# Altium schematic sheet F28335_V1.1.SchDoc
size C
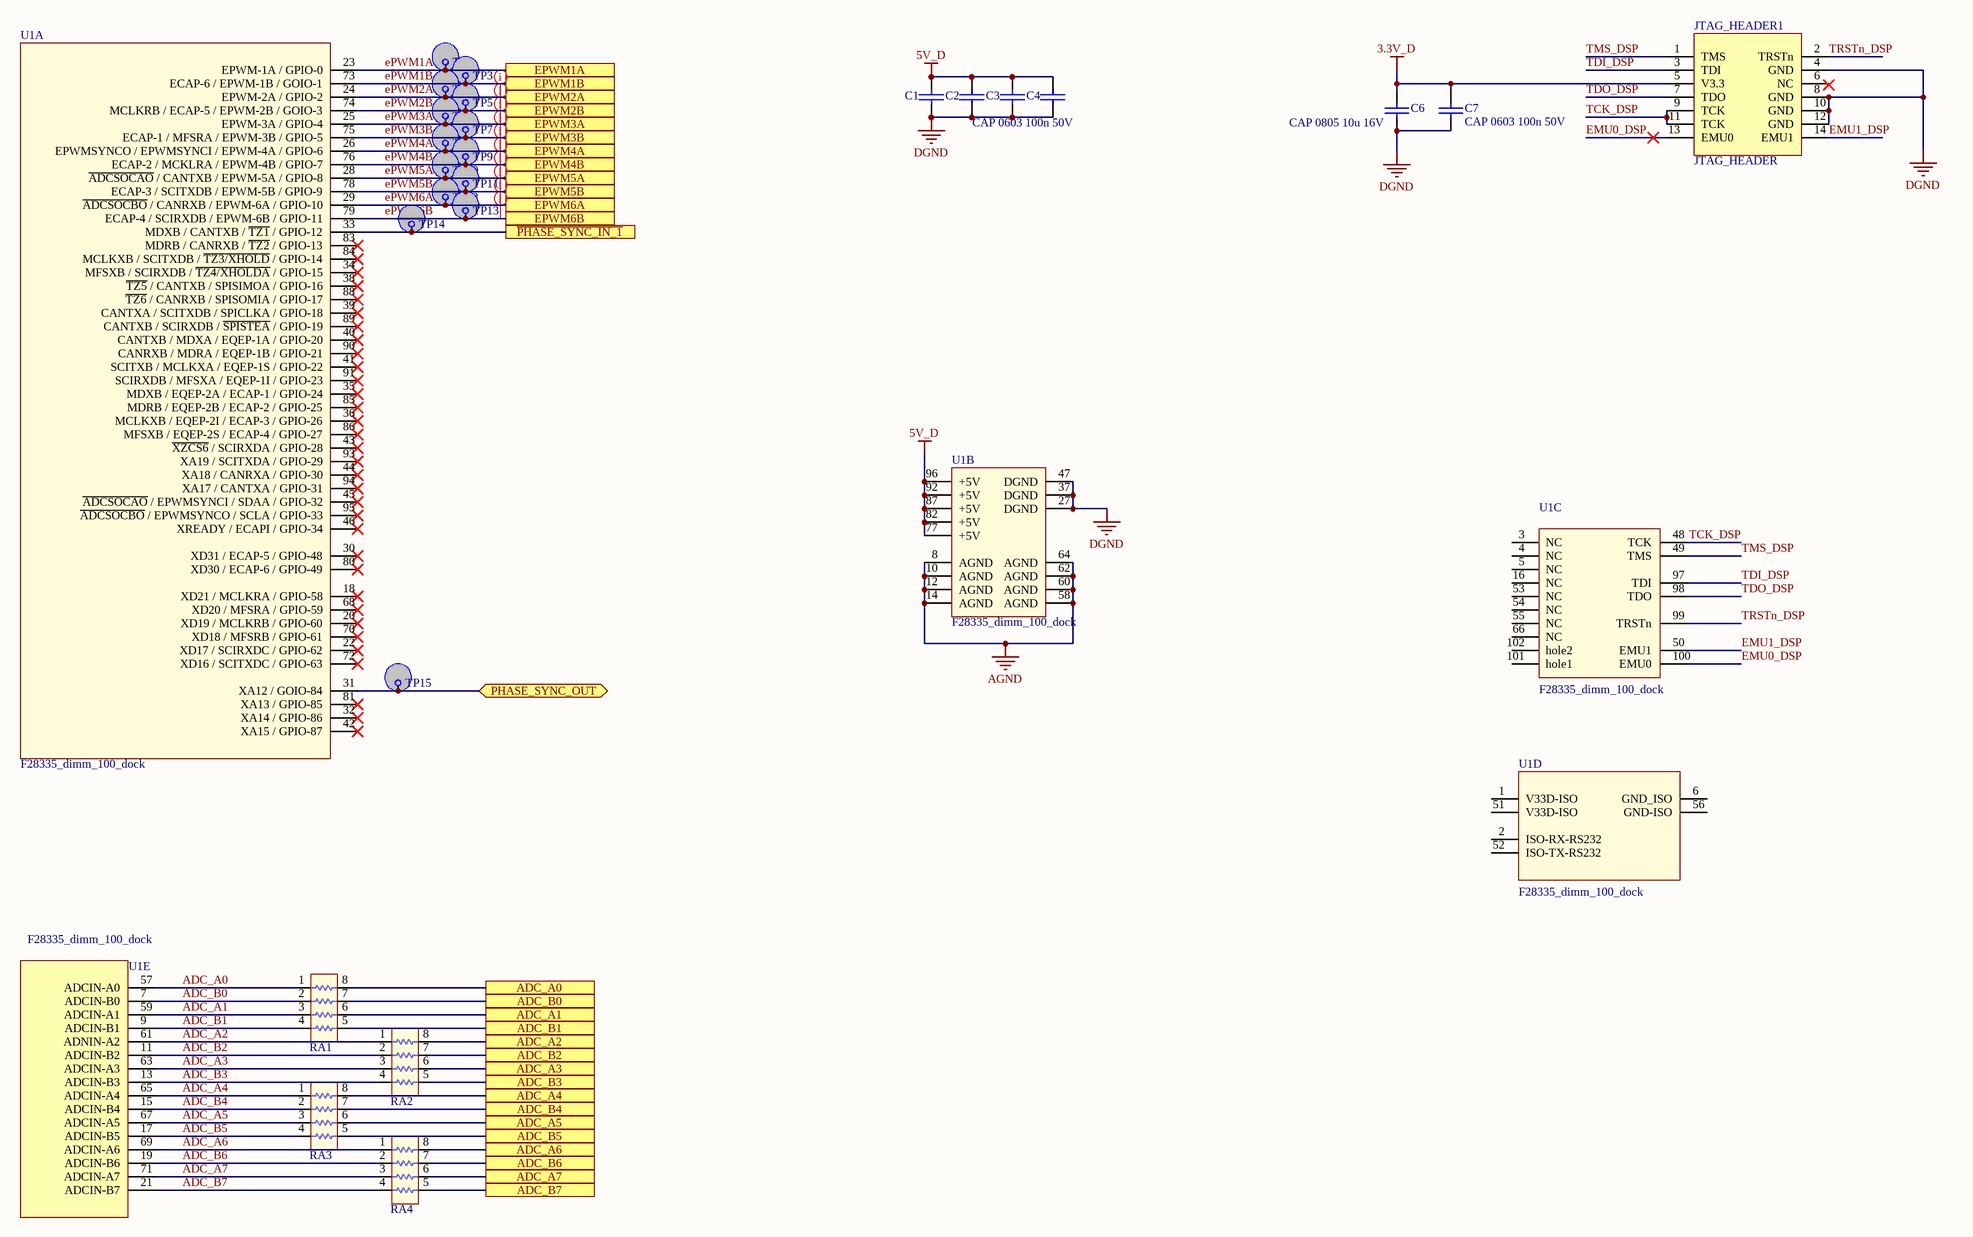
[diagram p0: F28335_V1.1.SchDoc]

## Parts
C1  CAP 0603 100n 50V  [CAPC1608N]
C2  CAP 0603 100n 50V  [CAPC1608N]  (value not drawn)
C3  CAP 0603 100n 50V  [CAPC1608N]  (value not drawn)
C4  CAP 0603 100n 50V  [CAPC1608N]  (value not drawn)
C6  CAP 0805 10u 16V  [CAPC2012N]
C7  CAP 0603 100n 50V  [CAPC1608N]
JTAG_HEADER1  JTAG_HEADER  [JTag_Header]
RA1  EXB38V 0 OHM  [EXB38V]  (value not drawn)
RA2  EXB38V 0 OHM  [EXB38V]  (value not drawn)
RA3  EXB38V 0 OHM  [EXB38V]  (value not drawn)
RA4  EXB38V 0 OHM  [EXB38V]  (value not drawn)
TP2  TEST_POINT_HOOK  [Keystone 5000]  (value not drawn)
TP3  TEST_POINT_HOOK  [Keystone 5000]  (value not drawn)
TP4  TEST_POINT_HOOK  [Keystone 5000]  (value not drawn)
TP5  TEST_POINT_HOOK  [Keystone 5000]  (value not drawn)
TP6  TEST_POINT_HOOK  [Keystone 5000]  (value not drawn)
TP7  TEST_POINT_HOOK  [Keystone 5000]  (value not drawn)
TP8  TEST_POINT_HOOK  [Keystone 5000]  (value not drawn)
TP9  TEST_POINT_HOOK  [Keystone 5000]  (value not drawn)
TP10  TEST_POINT_HOOK  [Keystone 5000]  (value not drawn)
TP11  TEST_POINT_HOOK  [Keystone 5000]  (value not drawn)
TP12  TEST_POINT_HOOK  [Keystone 5000]  (value not drawn)
TP13  TEST_POINT_HOOK  [Keystone 5000]  (value not drawn)
TP14  TEST_POINT_HOOK  [Keystone 5000]  (value not drawn)
TP15  TEST_POINT_HOOK  [Keystone 5000]  (value not drawn)
U1  F28335_dimm_100_dock  [DIMM_100_100mil]  (parts A,B,C,D,E of 5)

## Ports
ADC_A0, ADC_A1, ADC_A2, ADC_A3, ADC_A4, ADC_A5, ADC_A6, ADC_A7, ADC_B0, ADC_B1, ADC_B2, ADC_B3, ADC_B4, ADC_B5, ADC_B6, ADC_B7, EPWM1A, EPWM1B, EPWM2A, EPWM2B, EPWM3A, EPWM3B, EPWM4A, EPWM4B, EPWM5A, EPWM5B, EPWM6A, EPWM6B, PHASE_SYNC_OUT, ~{PHASE_SYNC_IN_1}

## Nets
3.3V_D: C6.1 C7.1 JTAG_HEADER1.5(V3.3)
5V_D: C1.1 C2.1 C3.1 C4.1 U1.77(+5V) U1.82(+5V) U1.87(+5V) U1.92(+5V) U1.96(+5V)
AGND: U1.8(AGND) U1.10(AGND) U1.12(AGND) U1.14(AGND) U1.58(AGND) U1.60(AGND) U1.62(AGND) U1.64(AGND)
DGND: C1.2 C2.2 C3.2 C4.2 C6.2 C7.2 JTAG_HEADER1.4(GND) JTAG_HEADER1.8(GND) JTAG_HEADER1.10(GND) JTAG_HEADER1.12(GND) U1.27(DGND) U1.37(DGND) U1.47(DGND)
~{PHASE_SYNC_IN_1}: TP14.1 U1.33(MDXB_/_CANTXB_/_~{TZ1}_/_GPIO-12) ; port ~{PHASE_SYNC_IN_1}
ADC_A0: RA1.1 U1.57(ADCIN-A0)
ADC_A0: RA1.8 ; port ADC_A0  [a separate net that carries the same name]
ADC_A1: RA1.3 U1.59(ADCIN-A1)
ADC_A1: RA1.6 ; port ADC_A1  [a separate net that carries the same name]
ADC_A2: RA2.1 U1.61(ADNIN-A2)
ADC_A2: RA2.8 ; port ADC_A2  [a separate net that carries the same name]
ADC_A3: RA2.3 U1.63(ADCIN-A3)
ADC_A3: RA2.6 ; port ADC_A3  [a separate net that carries the same name]
ADC_A4: RA3.1 U1.65(ADCIN-A4)
ADC_A4: RA3.8 ; port ADC_A4  [a separate net that carries the same name]
ADC_A5: RA3.3 U1.67(ADCIN-A5)
ADC_A5: RA3.6 ; port ADC_A5  [a separate net that carries the same name]
ADC_A6: RA4.1 U1.69(ADCIN-A6)
ADC_A6: RA4.8 ; port ADC_A6  [a separate net that carries the same name]
ADC_A7: RA4.3 U1.71(ADCIN-A7)
ADC_A7: RA4.6 ; port ADC_A7  [a separate net that carries the same name]
ADC_B0: RA1.2 U1.7(ADCIN-B0)
ADC_B0: RA1.7 ; port ADC_B0  [a separate net that carries the same name]
ADC_B1: RA1.4 U1.9(ADCIN-B1)
ADC_B1: RA1.5 ; port ADC_B1  [a separate net that carries the same name]
ADC_B2: RA2.2 U1.11(ADCIN-B2)
ADC_B2: RA2.7 ; port ADC_B2  [a separate net that carries the same name]
ADC_B3: RA2.4 U1.13(ADCIN-B3)
ADC_B3: RA2.5 ; port ADC_B3  [a separate net that carries the same name]
ADC_B4: RA3.2 U1.15(ADCIN-B4)
ADC_B4: RA3.7 ; port ADC_B4  [a separate net that carries the same name]
ADC_B5: RA3.4 U1.17(ADCIN-B5)
ADC_B5: RA3.5 ; port ADC_B5  [a separate net that carries the same name]
ADC_B6: RA4.2 U1.19(ADCIN-B6)
ADC_B6: RA4.7 ; port ADC_B6  [a separate net that carries the same name]
ADC_B7: RA4.4 U1.21(ADCIN-B7)
ADC_B7: RA4.5 ; port ADC_B7  [a separate net that carries the same name]
EMU0_DSP: JTAG_HEADER1.13(EMU0) U1.100(EMU0)
EMU1_DSP: JTAG_HEADER1.14(EMU1) U1.50(EMU1)
ePWM1A: TP2.1 U1.23(EPWM-1A_/_GPIO-0) ; port EPWM1A
ePWM1B: TP3.1 U1.73(ECAP-6_/_EPWM-1B_/_GOIO-1) ; port EPWM1B
ePWM2A: TP4.1 U1.24(EPWM-2A_/_GPIO-2) ; port EPWM2A
ePWM2B: TP5.1 U1.74(MCLKRB_/_ECAP-5_/_EPWM-2B_/_GOIO-3) ; port EPWM2B
ePWM3A: TP6.1 U1.25(EPWM-3A_/_GPIO-4) ; port EPWM3A
ePWM3B: TP7.1 U1.75(ECAP-1_/_MFSRA_/_EPWM-3B_/_GPIO-5) ; port EPWM3B
ePWM4A: TP8.1 U1.26(EPWMSYNCO_/_EPWMSYNCI_/_EPWM-4A_/_GPIO-6) ; port EPWM4A
ePWM4B: TP9.1 U1.76(ECAP-2_/_MCKLRA_/_EPWM-4B_/_GPIO-7) ; port EPWM4B
ePWM5A: TP10.1 U1.28(~{ADCSOCAO}_/_CANTXB_/_EPWM-5A_/_GPIO-8) ; port EPWM5A
ePWM5B: TP11.1 U1.78(ECAP-3_/_SCITXDB_/_EPWM-5B_/_GPIO-9) ; port EPWM5B
ePWM6A: TP12.1 U1.29(~{ADCSOCBO}_/_CANRXB_/_EPWM-6A_/_GPIO-10) ; port EPWM6A
ePWM6B: TP13.1 U1.79(ECAP-4_/_SCIRXDB_/_EPWM-6B_/_GPIO-11) ; port EPWM6B
PHASE_SYNC_OUT: TP15.1 U1.31(XA12_/_GOIO-84) ; port PHASE_SYNC_OUT
TCK_DSP: JTAG_HEADER1.9(TCK) JTAG_HEADER1.11(TCK) U1.48(TCK)
TDI_DSP: JTAG_HEADER1.3(TDI) U1.97(TDI)
TDO_DSP: JTAG_HEADER1.7(TDO) U1.98(TDO)
TMS_DSP: JTAG_HEADER1.1(TMS) U1.49(TMS)
TRSTn_DSP: JTAG_HEADER1.2(TRSTn) U1.99(TRSTn)

Not connected (* = marked no-connect by the designer): JTAG_HEADER1 6(NC); U1 1(V33D-ISO) 2(ISO-RX-RS232) 3(NC) 4(NC) 5(NC) 6(GND_ISO) 16(NC) 18(XD21_/_MCLKRA_/_GPIO-58)* 20(XD19_/_MCLKRB_/_GPIO-60)* 22(XD17_/_SCIRXDC_/_GPIO-62)* 30(XD31_/_ECAP-5_/_GPIO-48)* 32(XA14_/_GPIO-86)* 34(MFSXB_/_SCIRXDB_/_~{TZ4/XHOLDA}_/_GPIO-15)* 35(MDXB_/_EQEP-2A_/_ECAP-1_/_GPIO-24)* 36(MCLKXB_/_EQEP-2I_/_ECAP-3_/_GPIO-26)* 38(~{TZ5}_/_CANTXB_/_SPISIMOA_/_GPIO-16)* 39(CANTXA_/_SCITXDB_/_SPICLKA_/_GPIO-18)* 40(CANTXB_/_MDXA_/_EQEP-1A_/_GPIO-20)* 41(SCITXB_/_MCLKXA_/_EQEP-1S_/_GPIO-22)* 42(XA15_/_GPIO-87)* 43(~{XZCS6}_/_SCIRXDA_/_GPIO-28)* 44(XA18_/_CANRXA_/_GPIO-30)* 45(~{ADCSOCAO}_/_EPWMSYNCI_/_SDAA_/_GPIO-32)* 46(XREADY_/_ECAPI_/_GPIO-34)* 51(V33D-ISO) 52(ISO-TX-RS232) 53(NC) 54(NC) 55(NC) 56(GND-ISO) 66(NC) 68(XD20_/_MFSRA_/_GPIO-59)* 70(XD18_/_MFSRB_/_GPIO-61)* 72(XD16_/_SCITXDC_/_GPIO-63)* 80(XD30_/_ECAP-6_/_GPIO-49)* 81(XA13_/_GPIO-85)* 83(MDRB_/_CANRXB_/_~{TZ2}_/_GPIO-13)* 84(MCLKXB_/_SCITXDB_/_~{TZ3/XHOLD}_/_GPIO-14)* 85(MDRB_/_EQEP-2B_/_ECAP-2_/_GPIO-25)* 86(MFSXB_/_EQEP-2S_/_ECAP-4_/_GPIO-27)* 88(~{TZ6}_/_CANRXB_/_SPISOMIA_/_GPIO-17)* 89(CANTXB_/_SCIRXDB_/_~{SPISTEA}_/_GPIO-19)* 90(CANRXB_/_MDRA_/_EQEP-1B_/_GPIO-21)* 91(SCIRXDB_/_MFSXA_/_EQEP-1I_/_GPIO-23)* 93(XA19_/_SCITXDA_/_GPIO-29)* 94(XA17_/_CANTXA_/_GPIO-31)* 95(~{ADCSOCBO}_/_EPWMSYNCO_/_SCLA_/_GPIO-33)* 101(hole1) 102(hole2)

## Layout directives
net class FPGA: ePWM2A, ePWM2B, ePWM3A, ePWM3B, ePWM4A, ePWM4B, ePWM5A, ePWM5B, ePWM6A, ePWM6B

## Library data of the parts
C1-C4 C7 = CAP 0603 TBD: Vendor: TBD; Part#: TBD; Manuf: TBD; Manuf#: TBD; Cost: TBD
C6 = CAP 0805 TBD: Vendor: TBD; Part#: TBD; Manuf: TBD; Manuf#: TBD; Cost: TBD
JTAG_HEADER1 = JTAG_HEADER: Part#: 929975E-01-05-ND; Manuf: 3M; Manuf#: 929975-01-05-RK; Vendor: Digikey; Cost@10: 1.807
RA1-RA4 = EXB38V: EXB38V 0603*4 TBD